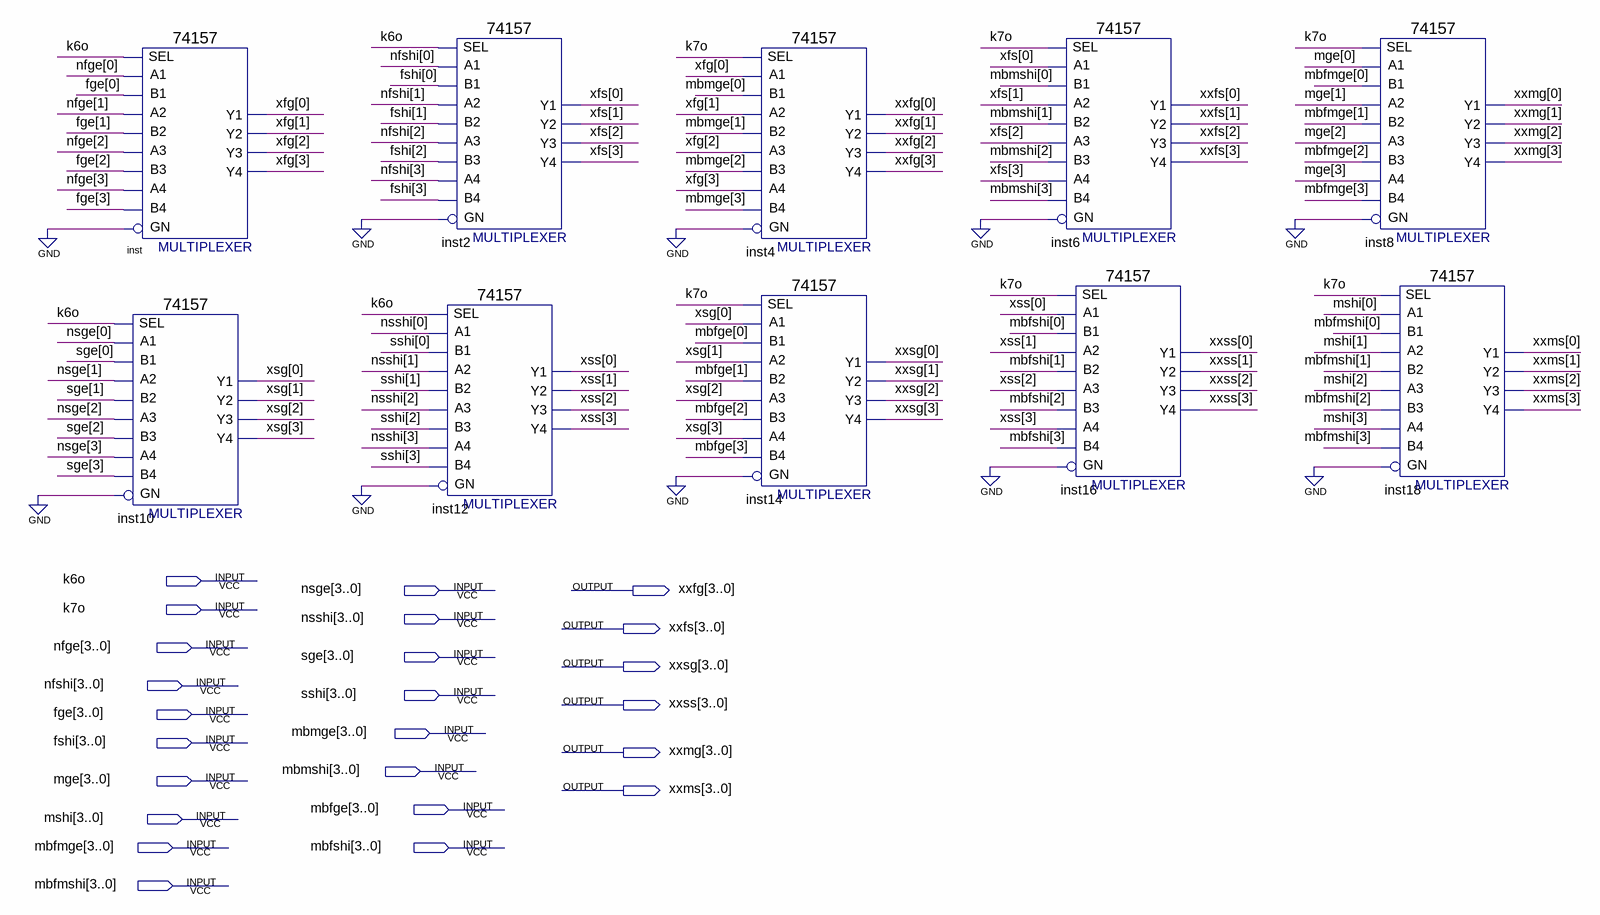
[diagram p0: schematic sheet]
// Quartus schematic moshiqiehuan.bdf as structural Verilog: 10 symbols, 24 pins
module moshiqiehuan (
  input  k6o,
  input  [3:0] nsge,
  input  k7o,
  input  [3:0] nsshi,
  input  [3:0] nfge,
  input  [3:0] sge,
  input  [3:0] nfshi,
  input  [3:0] sshi,
  input  [3:0] fge,
  input  [3:0] mbmge,
  input  [3:0] fshi,
  input  [3:0] mbmshi,
  input  [3:0] mge,
  input  [3:0] mbfge,
  input  [3:0] mshi,
  input  [3:0] mbfmge,
  input  [3:0] mbfshi,
  input  [3:0] mbfmshi,
  output [3:0] xxfg,
  output [3:0] xxfs,
  output [3:0] xxsg,
  output [3:0] xxss,
  output [3:0] xxmg,
  output [3:0] xxms
);

  wire [3:0] xfg, xfs, xsg, xss;

  \74157  inst10 (
    .A1(nsge[0]), .B1(sge[0]), .SEL(k6o), .B2(sge[1]), .A3(nsge[2]), .B3(sge[2]), .A2(nsge[1]), .B4(sge[3]),
    .GN(1'b0), .A4(nsge[3]), .Y2(xsg[1]), .Y1(xsg[0]), .Y4(xsg[3]), .Y3(xsg[2]));
  \74157  inst (
    .A1(nfge[0]), .B1(fge[0]), .SEL(k6o), .B2(fge[1]), .A3(nfge[2]), .B3(fge[2]), .A2(nfge[1]), .B4(fge[3]),
    .GN(1'b0), .A4(nfge[3]), .Y2(xfg[1]), .Y1(xfg[0]), .Y4(xfg[3]), .Y3(xfg[2]));
  \74157  inst2 (
    .A1(nfshi[0]), .B1(fshi[0]), .SEL(k6o), .B2(fshi[1]), .A3(nfshi[2]), .B3(fshi[2]), .A2(nfshi[1]),
    .B4(fshi[3]), .GN(1'b0), .A4(nfshi[3]), .Y2(xfs[1]), .Y1(xfs[0]), .Y4(xfs[3]), .Y3(xfs[2]));
  \74157  inst12 (
    .A1(nsshi[0]), .B1(sshi[0]), .SEL(k6o), .B2(sshi[1]), .A3(nsshi[2]), .B3(sshi[2]), .A2(nsshi[1]),
    .B4(sshi[3]), .GN(1'b0), .A4(nsshi[3]), .Y2(xss[1]), .Y1(xss[0]), .Y4(xss[3]), .Y3(xss[2]));
  \74157  inst4 (
    .A1(xfg[0]), .B1(mbmge[0]), .SEL(k7o), .B2(mbmge[1]), .A3(xfg[2]), .B3(mbmge[2]), .A2(xfg[1]),
    .B4(mbmge[3]), .GN(1'b0), .A4(xfg[3]), .Y2(xxfg[1]), .Y1(xxfg[0]), .Y4(xxfg[3]), .Y3(xxfg[2]));
  \74157  inst14 (
    .A1(xsg[0]), .B1(mbfge[0]), .SEL(k7o), .B2(mbfge[1]), .A3(xsg[2]), .B3(mbfge[2]), .A2(xsg[1]),
    .B4(mbfge[3]), .GN(1'b0), .A4(xsg[3]), .Y2(xxsg[1]), .Y1(xxsg[0]), .Y4(xxsg[3]), .Y3(xxsg[2]));
  \74157  inst6 (
    .A1(xfs[0]), .B1(mbmshi[0]), .SEL(k7o), .B2(mbmshi[1]), .A3(xfs[2]), .B3(mbmshi[2]), .A2(xfs[1]),
    .B4(mbmshi[3]), .GN(1'b0), .A4(xfs[3]), .Y2(xxfs[1]), .Y1(xxfs[0]), .Y4(xxfs[3]), .Y3(xxfs[2]));
  \74157  inst16 (
    .A1(xss[0]), .B1(mbfshi[0]), .SEL(k7o), .B2(mbfshi[1]), .A3(xss[2]), .B3(mbfshi[2]), .A2(xss[1]),
    .B4(mbfshi[3]), .GN(1'b0), .A4(xss[3]), .Y2(xxss[1]), .Y1(xxss[0]), .Y4(xxss[3]), .Y3(xxss[2]));
  \74157  inst8 (
    .A1(mge[0]), .B1(mbfmge[0]), .SEL(k7o), .B2(mbfmge[1]), .A3(mge[2]), .B3(mbfmge[2]), .A2(mge[1]),
    .B4(mbfmge[3]), .GN(1'b0), .A4(mge[3]), .Y2(xxmg[1]), .Y1(xxmg[0]), .Y4(xxmg[3]), .Y3(xxmg[2]));
  \74157  inst18 (
    .A1(mshi[0]), .B1(mbfmshi[0]), .SEL(k7o), .B2(mbfmshi[1]), .A3(mshi[2]), .B3(mbfmshi[2]), .A2(mshi[1]),
    .B4(mbfmshi[3]), .GN(1'b0), .A4(mshi[3]), .Y2(xxms[1]), .Y1(xxms[0]), .Y4(xxms[3]), .Y3(xxms[2]));
endmodule
